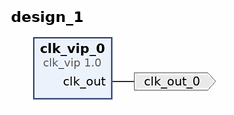
[diagram p0: block diagram of the top level]
# Vivado block design design_1, xc7z010clg400-1, Vivado 2022.2
create_bd_design design_1

create_bd_port -dir O -type clk clk_out_0

create_bd_cell -type ip -vlnv xilinx.com:ip:clk_vip:1.0 clk_vip_0
set_property -dict {CONFIG.INTERFACE_MODE MASTER} [get_bd_cells clk_vip_0]

# ---- connections ----

connect_bd_net [get_bd_pins clk_vip_0/clk_out] [get_bd_ports clk_out_0]

validate_bd_design
save_bd_design
